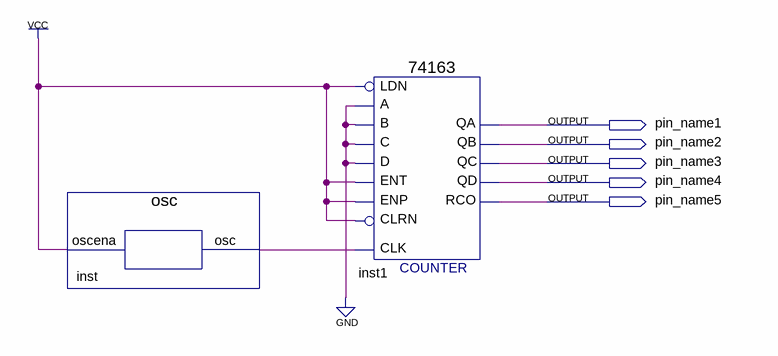
[diagram p0: schematic sheet]
// Quartus schematic InternalOscillator.bdf as structural Verilog: 2 symbols, 5 pins
module InternalOscillator (
  output pin_name1,
  output pin_name2,
  output pin_name3,
  output pin_name4,
  output pin_name5
);

  wire inst_osc;

  osc inst (.oscena(1'b1), .osc(inst_osc));
  \74163  inst1 (
    .C(1'b0), .B(1'b0), .A(1'b0), .ENT(1'b1), .D(1'b0), .CLRN(1'b1), .CLK(inst_osc), .ENP(1'b1), .LDN(1'b1),
    .QA(pin_name1), .QB(pin_name2), .QC(pin_name3), .QD(pin_name4), .RCO(pin_name5));
endmodule
